# EAGLE design NOR_Memory_Card (EAGLE 9.3.0)
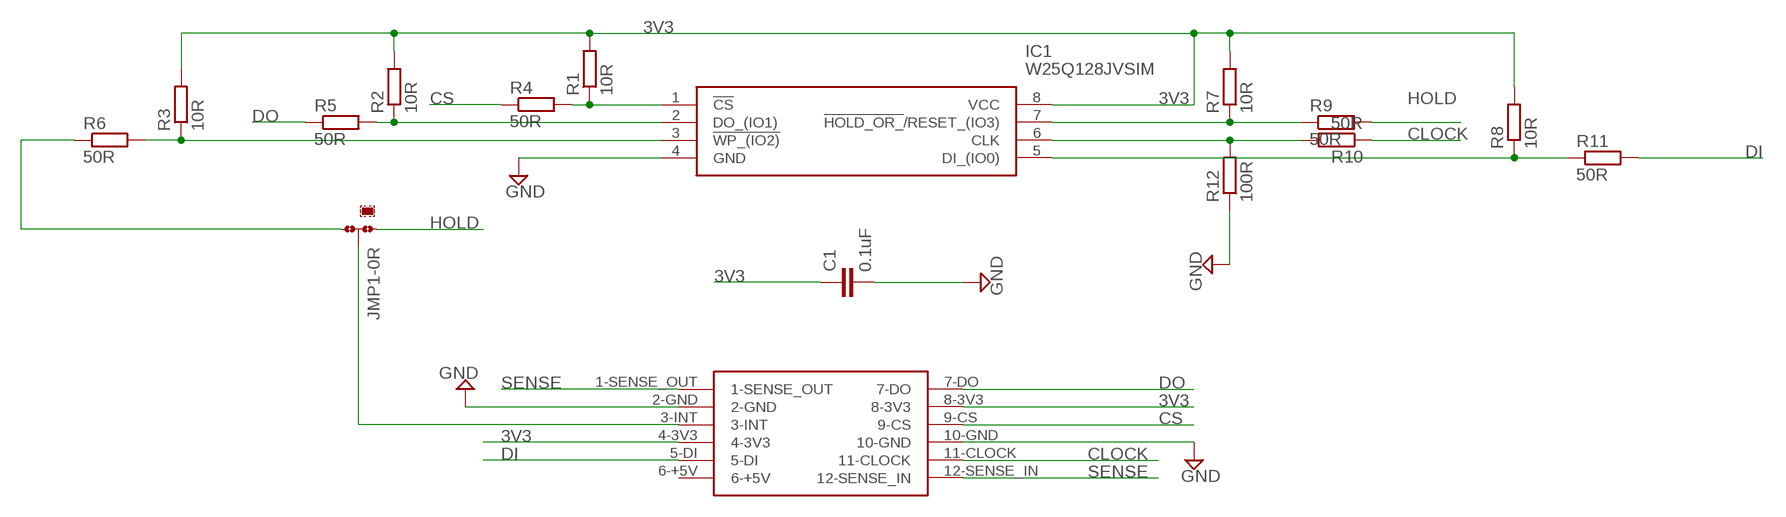
[diagram p0: schematic, sheet 1]

## Parts
C1  0.1uF  C-EUC0805  [C0805]
IC1  W25Q128JVSIM  [SOIC127P790X216-8N]
JMP1  0R-JUMPA  [A0R-JMP]
R1  10R  R-EU_R0805  [R0805]
R2  10R  R-EU_R0805  [R0805]
R3  10R  R-EU_R0805  [R0805]
R4  50R  R-EU_R0805  [R0805]
R5  50R  R-EU_R0805  [R0805]
R6  50R  R-EU_R0805  [R0805]
R7  10R  R-EU_R0805  [R0805]
R8  10R  R-EU_R0805  [R0805]
R9  50R  R-EU_R0805  [R0805]
R10  50R  R-EU_R0805  [R0805]
R11  50R  R-EU_R0805  [R0805]
R12  100R  R-EU_R0805  [R0805]
U$1  MEM_CARD_CONN  [MEM_CARD_CONN]

## Nets
3V3: C1.1 IC1.8(VCC) R1.2 R2.2 R3.2 R7.2 R8.2 U$1.4-3V3 U$1.8-3V3
CLOCK: R10.1 U$1.11-CLOCK
CS: R4.1 U$1.9-CS
DI: R11.2 U$1.5-DI
DO: R5.1 U$1.7-DO
GND: C1.2 IC1.4(GND) R12.1 U$1.2-GND U$1.10-GND
HOLD: JMP1.1 R9.2
N$1: IC1.7(!HOLD_OR_!/RESET_(IO3)) R7.1 R9.1
N$2: IC1.6(CLK) R10.2 R12.2
N$3: JMP1.3 R6.1
N$4: IC1.3(!WP_(IO2)) R3.1 R6.2
N$5: IC1.5(DI_(IO0)) R8.1 R11.1
N$6: IC1.2(DO_(IO1)) R2.1 R5.2
N$7: IC1.1(!CS) R1.1 R4.2
N$8: JMP1.2 U$1.3-INT
SENSE: U$1.1-SENSE_OUT U$1.12-SENSE_IN
Unconnected: U$1.6-+5V

## Library data of the parts
C1 = rcl:C-EU: CAPACITOR, European symbol; SPICEPREFIX: C
IC1 = W25Q128JVSIM:W25Q128JVSIM: Winbond, W25Q128JVSIM Source: Datasheet <http://www.winbond.com/resource-files/w25q128jv_dtr revc 03272018 plus.pdf>; DESCRIPTION: Winbond, W25Q128JVSIM; HEIGHT: 2.16mm; MANUFACTURER_NAME: Winbond; MANUFACTURER_PART_NUMBER: W25Q128JVSIM; MOUSER_PART_NUMBER: 454-W25Q128JVSIM; MOUSER_PRICE-STOCK: https://www.mouser.com/Search/Refine.aspx?Keyword=454-W25Q128JVSIM; RS_PART_NUMBER: 1882648; RS_PRICE-STOCK: http://uk.rs-online.com/web/p/products/1882648
JMP1 = jump-0r-smd:0R-JUMP: SMD 0R 0805 Jumper
R1-R12 = rcl:R-EU_: RESISTOR, European symbol; SPICEPREFIX: R
U$1 = NGC_Parts:MEM_CARD_CONN

## Board
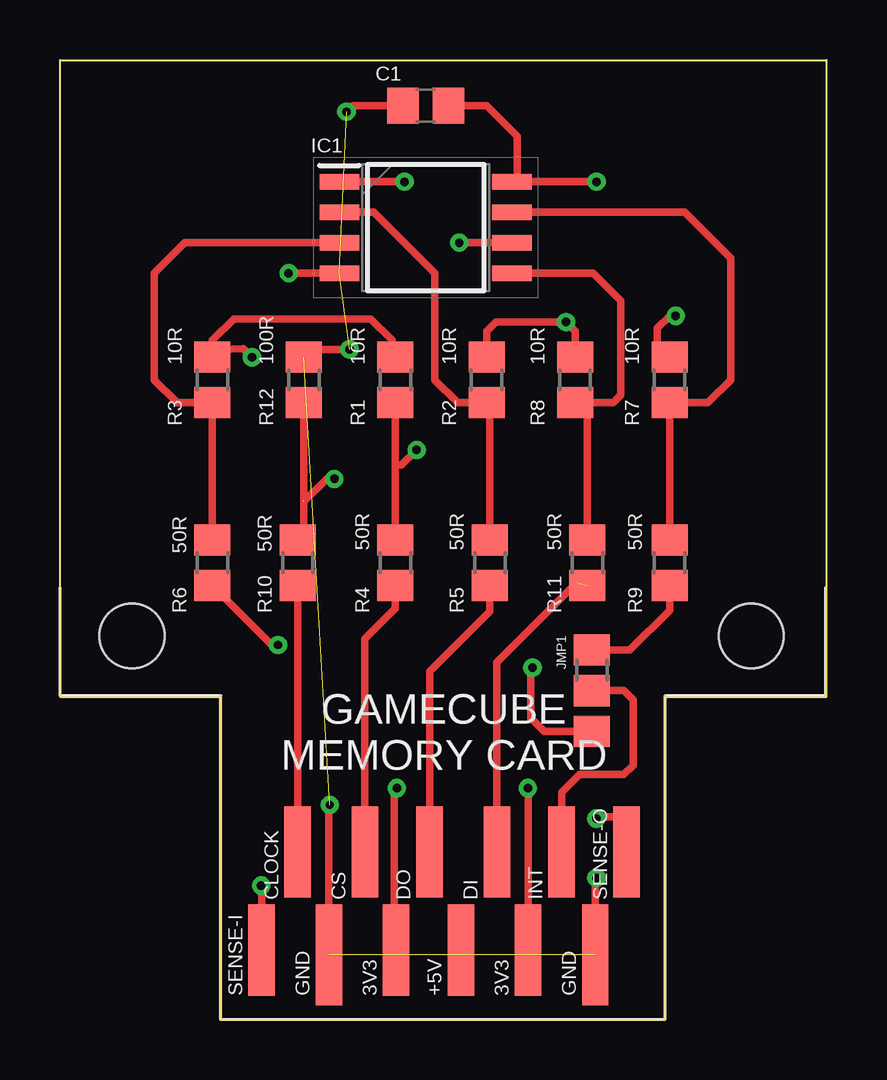
[diagram p1: board, top side]
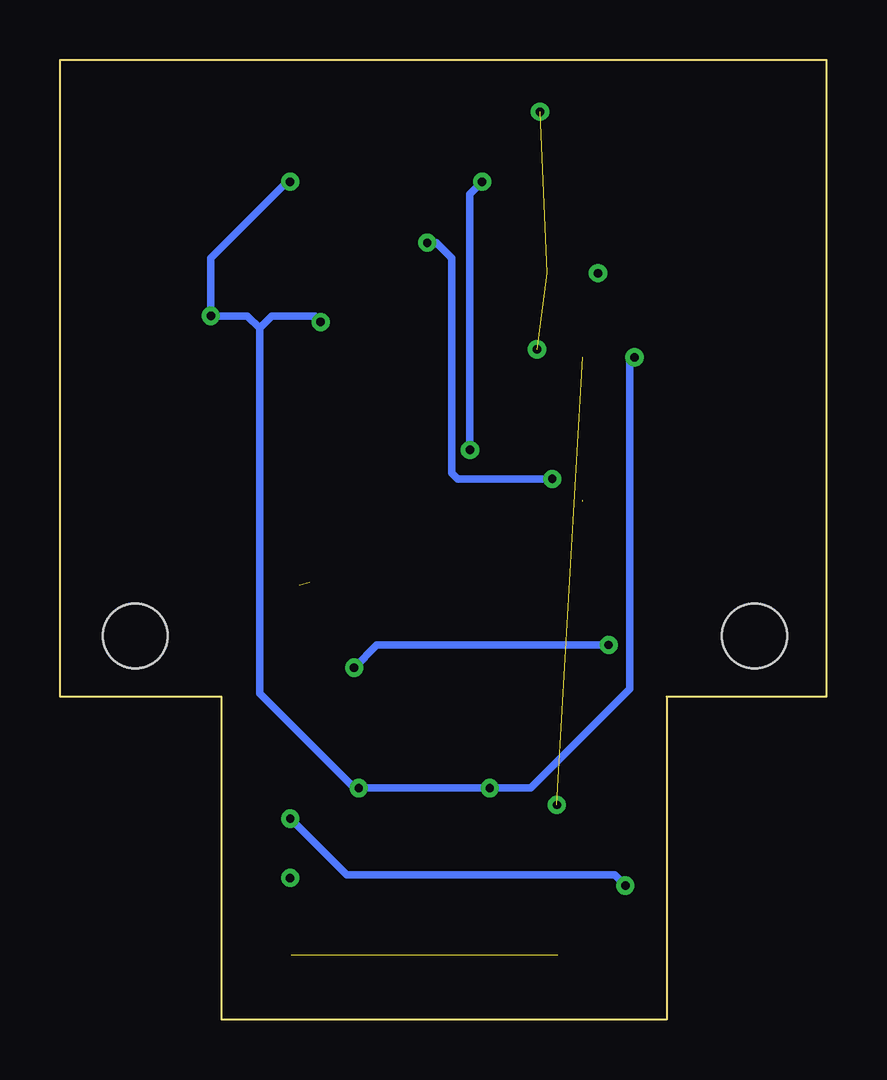
[diagram p2: board, bottom side, seen from below]

Size 31.94 x 40.01 mm. Coordinates in mm from the lower left corner, seen from the top.
Outline: 0,13.46 6.67,13.46 6.67,0 25.21,0 25.21,13.46 31.94,13.46 31.94,40.01 0,40.01 0,13.46
Copper layers (1*16): Top 0.035mm / dielectric 1.5mm / Bottom 0.035mm
Design rules "default": minimum track width 6mil, minimum drill 0.35mm, track to track 6mil, track to pad 6mil, pad to pad 6mil, via to via 6mil, smd to smd 6mil, copper to edge 40mil, drill to drill 6mil, minimum pad ring 10mil, minimum via ring 8mil, stop-mask expansion 4mil, vias tented up to drill 0mil, thermal gap 10mil

### Footprints (pad centres in the part's own frame; a part is rotated, then mirrored left to right if it is on the bottom)
C0805 = smd 1.3 x 1.5: 1 -0.95,0; 2 0.95,0
SOIC127P790X216-8N = smd 1.65 x 0.65: 1 -3.6,1.905; 2 -3.6,0.635; 3 -3.6,-0.635; 4 -3.6,-1.905; 5 3.6,-1.905; 6 3.6,-0.635; 7 3.6,0.635; 8 3.6,1.905
A0R-JMP = smd 1.5 x 1.3: 1 0,1.7; 2 0,0; 3 0,-1.7
R0805 = smd 1.3 x 1.5: 1 -0.95,0; 2 0.95,0
MEM_CARD_CONN = smd 1.1 x 3.8: 1-SENSE_OUT 23.6,7; 3-INT 20.9,7; 4-3V3 19.5,2.9; 5-DI 18.2,7; 6-+5V 16.7,2.9; 7-DO 15.4,7; 8-3V3 14,2.9; 9-CS 12.7,7; 11-CLOCK 9.9,7; 12-SENSE_IN 8.4,2.9 | smd 1.1 x 4.2: 2-GND 22.3,2.7; 10-GND 11.2,2.7 | hole 2.7: 28.8,16; 3,16

### Placement (x,y rotation side)
C1  15.24,38.1 180 top
IC1  15.24,33.02 0 top
JMP1  22.16,13.72 0 top
R1  13.97,26.67 90 top
R2  17.78,26.67 90 top
R3  6.35,26.67 90 top
R4  13.97,19.05 90 top
R5  17.91,19.05 90 top
R6  6.35,19.05 90 top
R7  25.4,26.67 90 top
R8  21.46,26.67 90 top
R9  25.4,19.05 270 top
R10  9.91,19.05 90 top
R11  21.97,19.05 270 top
R12  10.16,26.67 270 top
U$1  0,0 0 top

### Tracks (layer width: path | path; a pad name or v marks a point on that pad's centre or on a via)
3V3  (via drill 0.35)
  Top 0.305: C1.1 17.78,38.1 19.05,36.83 19.05,35.13 IC1.8 v22.35,34.92 | R1.2 13.84,27.75 13.84,28.32 12.95,29.21 7.24,29.21 6.35,28.32 R3.2 6.67,27.94 7.64,27.97 v8,27.61 | U$1.4-3V3 v19.5,9.65 v19.49,9.65 | U$1.8-3V3 13.94,2.96 13.94,9.65 v14.03,9.65 | R2.2 17.78,28.7 18.16,29.08 v21.08,29.08 21.46,28.7 R8.2 | R7.2 24.89,28.13 24.89,28.83 25.4,29.34 v25.65,29.34
  Bottom 0.305: 22.48,34.92 22.61,34.8 | 22.61,34.8 22.48,34.8 v22.35,34.92 | v8,27.61 8.19,27.42 8.19,13.78 12.32,9.65 v14.03,9.65 v19.49,9.65 19.68,9.65 23.62,13.59 23.62,28.83 | 22.61,34.8 25.65,31.75 v25.65,29.34 24.13,29.34 23.62,28.83 | v21.08,29.08 21.34,29.34 23.11,29.34 23.62,28.83
CLOCK
  Top 0.305: R10.1 U$1.11-CLOCK
CS
  Top 0.305: R4.1 13.97,17.15 12.7,15.88 U$1.9-CS
DI  (1 unrouted)
  Top 0.305: 21.53,18.23 18.2,14.9 U$1.5-DI
DO
  Top 0.305: R5.1 17.91,17.02 15.4,14.51 U$1.7-DO
GND  (via drill 0.35)  (4 unrouted)
  Top 0.305: R12.1 10.16,27.94 v12.06,27.94 | IC1.4 v9.53,31.11 | U$1.10-GND 11.2,8.95 v11.24,8.95 | U$1.2-GND 22.3,5.85 v22.35,5.91 | C1.2 12.19,38.1 v11.94,37.85
HOLD
  Top 0.305: R9.2 25.4,17.07 23.75,15.42 JMP1.1
N$1
  Top 0.305: R9.1 R7.1 26.99,25.72 27.94,26.67 27.94,31.75 26.04,33.66 IC1.7
N$2  (via drill 0.35)  (1 unrouted)
  Top 0.305: R10.2 10.16,20.25 10.16,21.59 11.11,22.54 v11.43,22.54 | 10.16,21.65 R12.2 | IC1.6 v16.64,32.38
  Bottom 0.305: v11.43,22.54 15.37,22.54 15.62,22.8 15.62,31.75 16.26,32.38 v16.64,32.38
N$3  (via drill 0.35)
  Top 0.305: JMP1.3 20.18,12.02 19.62,12.57 19.62,14.61 v19.68,14.67 | v9.08,15.62 8.83,15.62 R6.1
  Bottom 0.305: v19.68,14.67 18.73,15.62 v9.08,15.62
N$4
  Top 0.305: R6.2 R3.1 4.89,25.72 3.94,26.67 3.94,31.11 5.21,32.38 IC1.3
N$5
  Top 0.305: R11.1 21.97,25.21 R8.1 23.05,25.72 23.37,26.04 23.37,29.97 22.23,31.11 IC1.5
N$6
  Top 0.305: R5.2 17.91,25.59 R2.1 16.57,25.72 15.62,26.67 15.62,31.11 13.08,33.66 IC1.2
N$7  (via drill 0.35)
  Top 0.305: R4.2 R1.1 13.97,23.11 14.22,23.11 v14.86,23.75 | IC1.1 v14.35,34.92
  Bottom 0.305: v14.86,23.75 14.86,34.42 v14.35,34.92
N$8
  Top 0.305: U$1.3-INT 20.9,9.47 21.65,10.22 23.5,10.22 23.88,10.6 23.88,13.34 23.5,13.72 JMP1.2
SENSE  (via drill 0.35)
  Top 0.305: 8.38,2.92 U$1.12-SENSE_IN 8.4,5.57 v8.38,5.59 | U$1.1-SENSE_OUT 23.6,8.53 23.52,8.45 22.41,8.45 v22.35,8.38
  Bottom 0.305: v8.38,5.59 8.83,6.03 20,6.03 v22.35,8.38